# EAGLE design AD5933_Breakout (EAGLE 6.4)
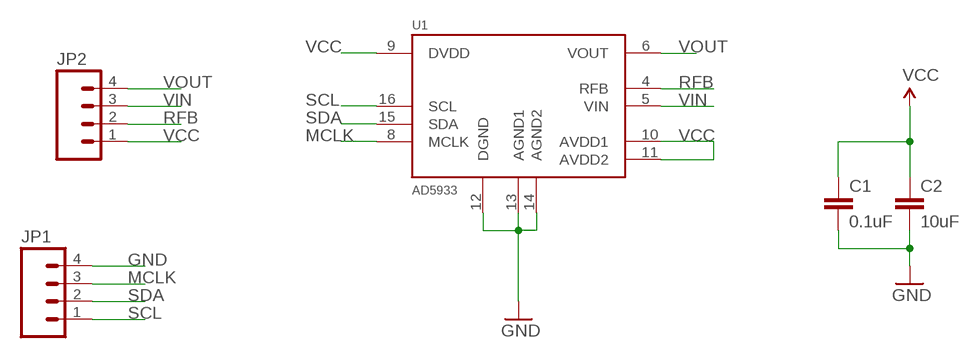
[diagram p0: schematic, sheet 1]

## Parts
C1  0.1uF  0.1UF-100V-10%(0603)  [0603-CAP]
C2  10uF  0.1UF-100V-10%(0603)  [0603-CAP]
JP1  M04PTH  [1X04]
JP2  M04PTH  [1X04]
U1  AD5933  [SSOP16]

## Nets
GND: C1.2 C2.2 JP1.4 U1.12(DGND) U1.13(AGND1) U1.14(AGND2)
MCLK: JP1.3 U1.8(MCLK)
RFB: JP2.2 U1.4(RFB)
SCL: JP1.1 U1.16(SCL)
SDA: JP1.2 U1.15(SDA)
VCC: C1.1 C2.1 JP2.1 U1.9(DVDD) U1.10(AVDD1) U1.11(AVDD2)
VIN: JP2.3 U1.5(VIN)
VOUT: JP2.4 U1.6(VOUT)

## Library data of the parts
C1 = SparkFun-Capacitors:0.1UF-100V-10%(0603): CAP-08390; PROD_ID: CAP-08390
C2 = SparkFun-Capacitors:0.1UF-100V-10%(0603): CAP-08390; PROD_ID: CAP-08390; VALUE: 0.1uF
JP1 JP2 = SparkFun-Connectors:M04: Header 4 Standard 4-pin 0.1" header. Use with straight break away headers (SKU : PRT-00116), right angle break away headers (PRT-00553), swiss pins (PRT-00743), machine pins (PRT-00117), and female headers (PRT-00115). Molex polarized connector foot print use with SKU : PRT-08231 with associated crimp pins and housings. 1MM SMD Version SKU: PRT-10208
U1 = kblom:AD5933: 1 MSPS, 12-Bit Impedance Converter, Network Analyzer Applications: Electrochemical analysis Bioelectrical impedance analysis Impedance spectroscopy Complex impedance measurement Corrosion monitoring and protection equipment Biomedical and automotive sensors Proximity sensing Nondestructive testing Material property analysis Fuel/battery cell condition monitoring source <http://www.analog.com/static/imported-files/data_sheets/AD5933.pdf>

## Board
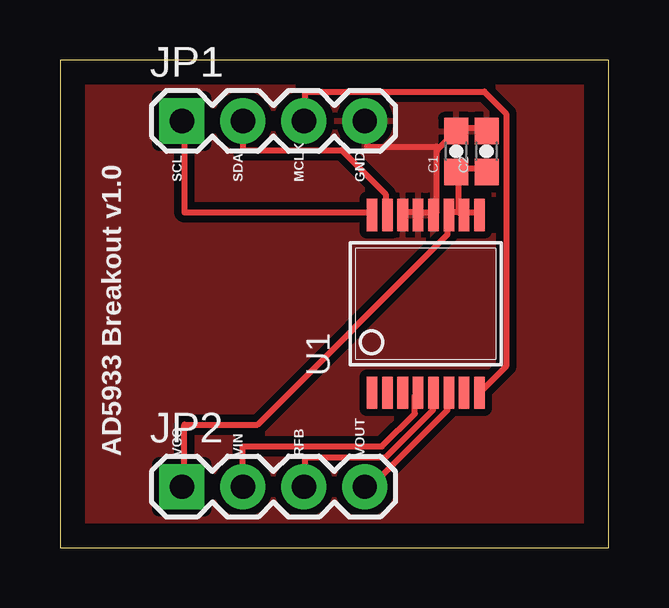
[diagram p1: board, top side]
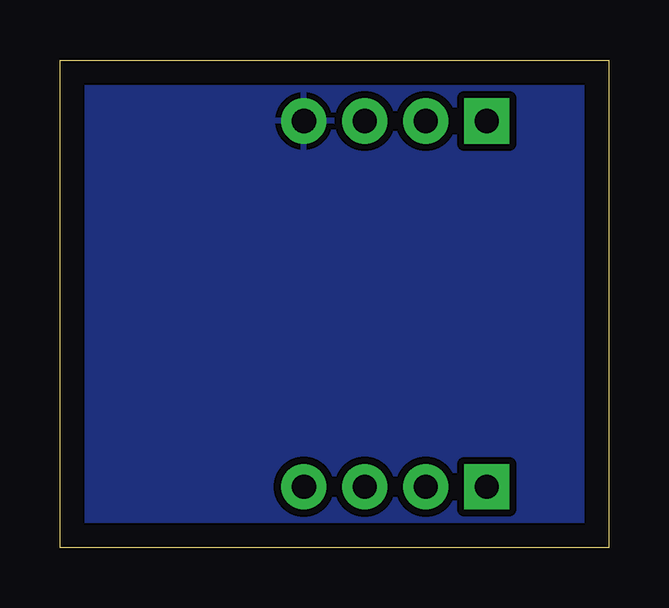
[diagram p2: board, bottom side, seen from below]

Size 22.86 x 20.32 mm. Coordinates in mm from the lower left corner, seen from the top.
Outline: 0,0 22.86,0 22.86,20.32 0,20.32 0,0
Copper layers (1*16): Top 0.035mm / dielectric 1.5mm / Bottom 0.035mm
Design rules "default *": minimum track width 10mil, minimum drill 24mil, track to track 6mil, track to pad 6mil, pad to pad 6mil, via to via 6mil, smd to smd 6mil, copper to edge 40mil, drill to drill 8mil, minimum pad ring 10mil, minimum via ring 8mil, stop-mask expansion 4mil, vias tented up to drill 0mil, thermal gap 10mil

### Footprints (pad centres in the part's own frame; a part is rotated, then mirrored left to right if it is on the bottom)
0603-CAP = smd 1.1 x 1: 1 -0.85,0; 2 0.85,0
1X04 = drill 1.016 pad 1.88 square: 1 0,0 | drill 1.016 pad 1.88: 2 2.54,0; 3 5.08,0; 4 7.62,0
SSOP16 = smd 0.44 x 1.34: 1 -2.24,-3.7; 2 -1.6,-3.7; 3 -0.96,-3.7; 4 -0.32,-3.7; 5 0.32,-3.7; 6 0.96,-3.7; 7 1.6,-3.7; 8 2.24,-3.7; 9 2.24,3.7; 10 1.6,3.7; 11 0.96,3.7; 12 0.32,3.7; 13 -0.32,3.7; 14 -0.96,3.7; 15 -1.6,3.7; 16 -2.24,3.7

### Placement (x,y rotation side)
C1  16.51,16.51 90 top
C2  17.78,16.51 90 top
JP1  5.08,17.78 0 top
JP2  5.08,2.54 0 top
U1  15.24,10.16 0 top

### Tracks (layer width: path | path; a pad name or v marks a point on that pad's centre or on a via)
GND
  Top 0.254: C2.2 17.68,17.48 16.61,17.48 C1.2 16.46,17.32 15.77,16.64 | U1.14 14.33,13.97 14.78,13.97 U1.13 14.94,13.97 15.54,13.97 U1.12 15.7,13.97 15.7,16.56 15.77,16.64 | 15.77,16.64 15.7,16.71 12.8,16.71 12.8,17.78 JP1.4
  pour Top (isolate 0.305): 0,20.32 22.86,20.32 22.86,0 0,0
  pour Bottom (isolate 0.305): 0,20.32 22.86,20.32 22.86,0 0,0
MCLK
  Top 0.254: U1.8 17.53,6.5 18.59,7.57 18.59,18.09 17.68,19 10.21,19 10.21,17.78 JP1.3
RFB
  Top 0.254: JP2.2 7.62,4.22 13.41,4.22 14.78,5.59 14.78,6.35 U1.4
SCL
  Top 0.254: U1.16 12.95,13.97 5.18,13.97 5.18,17.78 JP1.1
SDA
  Top 0.254: JP1.2 7.62,16.56 11.73,16.56 13.56,14.73 13.56,13.97 U1.15
VCC
  Top 0.254: C2.1 17.68,15.8 16.61,15.8 C1.1 16.61,15.65 16.61,13.97 | 16.61,13.97 16.76,13.97 U1.10 16.92,13.97 17.37,13.97 U1.9 | 16.61,13.97 16.31,13.97 U1.11 16.15,13.82 16.15,13.06 8.23,5.13 5.18,5.13 5.18,2.54 JP2.1
VIN
  Top 0.254: U1.5 15.54,6.35 15.54,5.74 13.56,3.76 10.21,3.76 10.21,2.54 JP2.3
VOUT
  Top 0.254: JP2.4 12.95,2.54 16.15,5.74 16.15,6.35 U1.6

### Text on the board
tPlace: SCL | SDA | MCLK | GND | AD5933 Breakout v1.0 | VCC | VIN | RFB | VOUT